# EAGLE design amc7135-by-12-16mm-led-aux-driver-mk-1.0 (EAGLE 7.5.0)
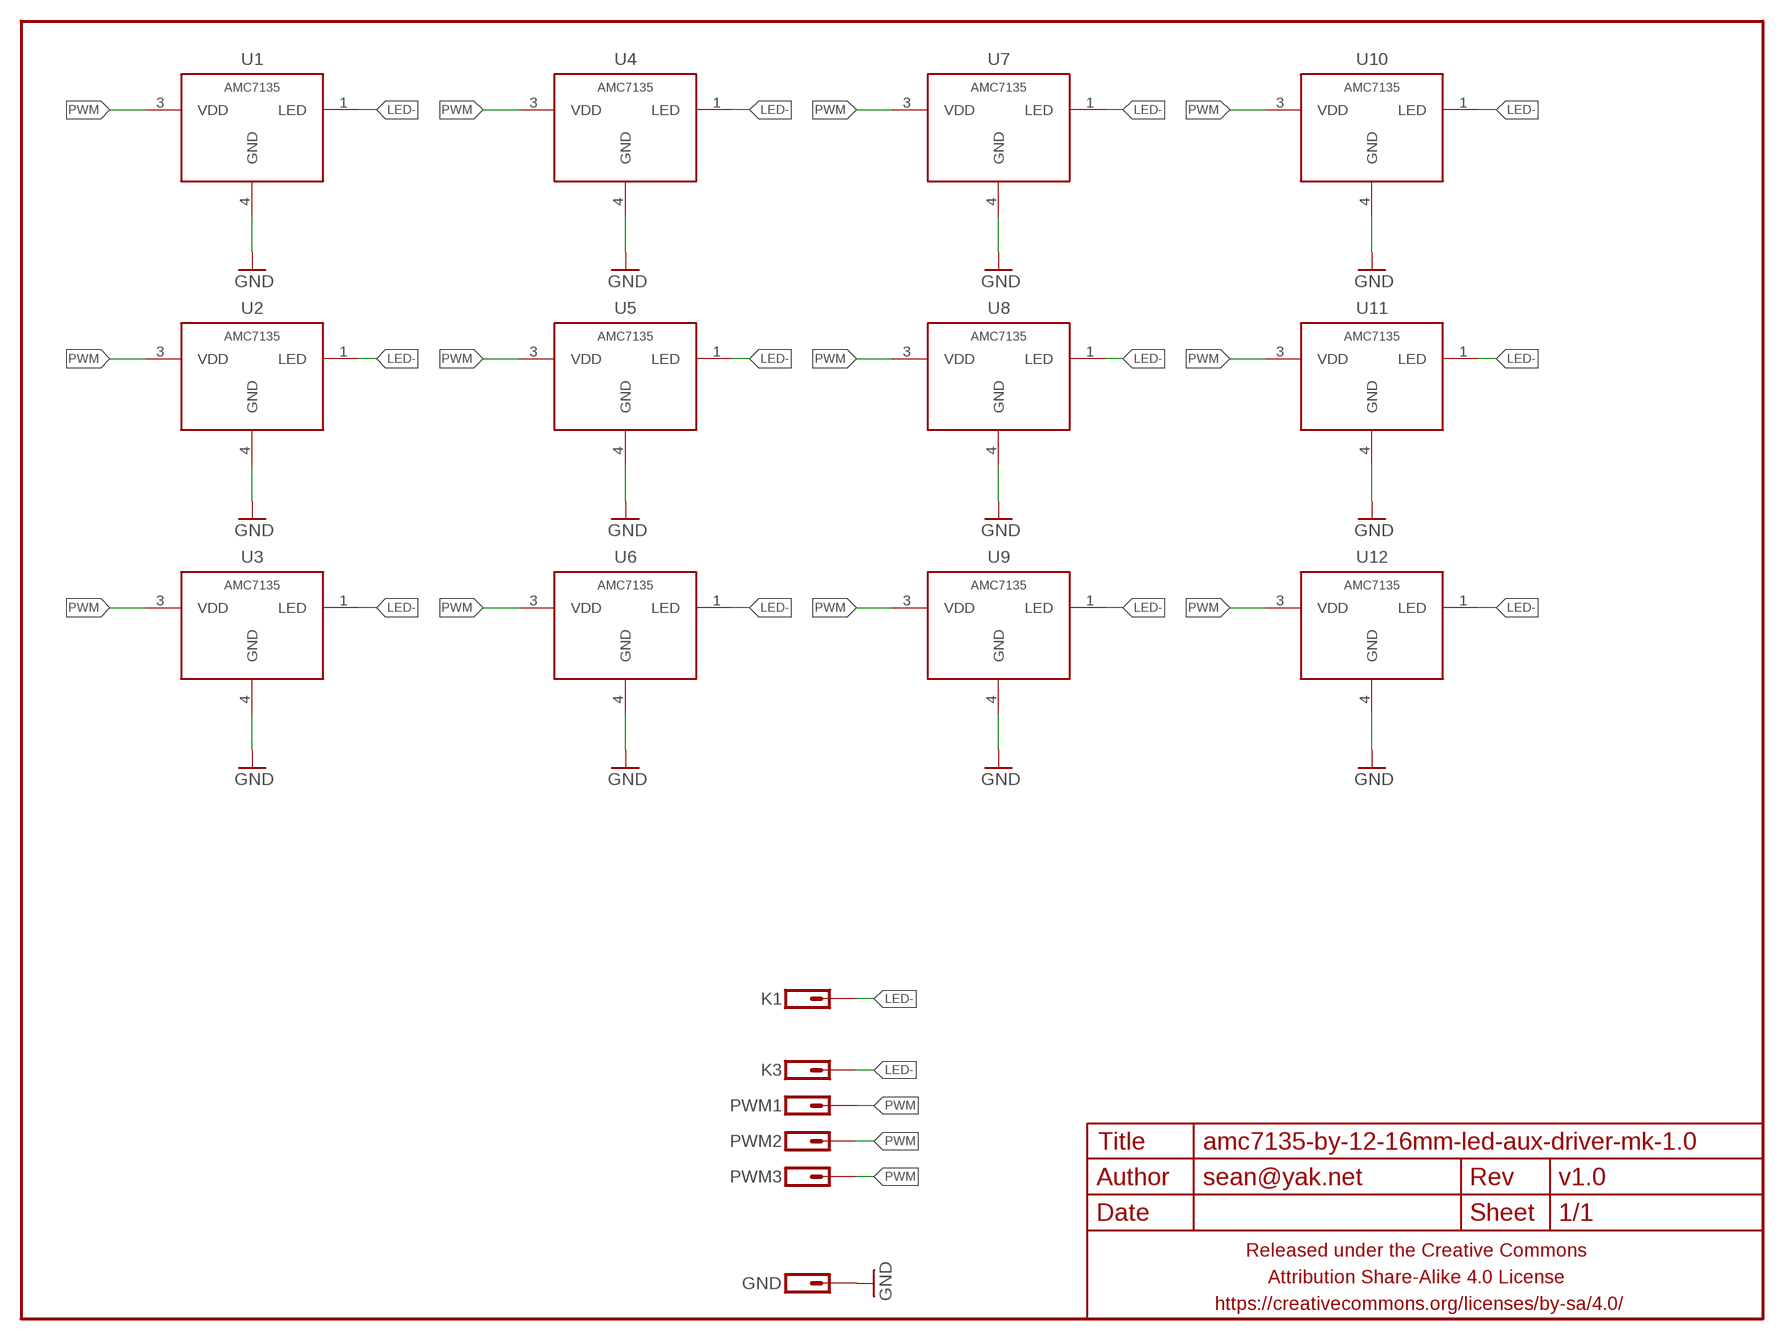
[diagram p0: schematic, sheet 1]

## Parts
FRAME1  FRAME-LETTERNO_PACKAGE  [DUMMY]
GND  M01SMD-1MM-DIA-NS  [1X01-SMD-1MM-DIA-NS]
K1  M011X01-0.9MM-CIR  [1X01-0.9MM-CIR]
K3  M01SMD-1MM-DIA-NS  [1X01-SMD-1MM-DIA-NS]
PWM1  M01PTH-0.7MM  [1X01-0.7MM]
PWM2  M01PTH-0.7MM  [1X01-0.7MM]
PWM3  M01SMD-1MM-DIA-NS  [1X01-SMD-1MM-DIA-NS]
U1  AMC7135  AMC7135SOT-89-NOTHERM-ROUNDED-LESS  [SOT89-NOTHERM-ROUNDED-LESS]
U2  AMC7135  AMC7135SOT-89-NOTHERM-ROUNDED-LESS  [SOT89-NOTHERM-ROUNDED-LESS]
U3  AMC7135  AMC7135SOT-89-NOTHERM-ROUNDED-LESS  [SOT89-NOTHERM-ROUNDED-LESS]
U4  AMC7135  AMC7135SOT-89-NOTHERM-ROUNDED-LESS  [SOT89-NOTHERM-ROUNDED-LESS]
U5  AMC7135  AMC7135SOT-89-NOTHERM-ROUNDED-LESS  [SOT89-NOTHERM-ROUNDED-LESS]
U6  AMC7135  AMC7135SOT-89-NOTHERM-ROUNDED-LESS  [SOT89-NOTHERM-ROUNDED-LESS]
U7  AMC7135  AMC7135SOT-89-NOTHERM-ROUNDED-LESS  [SOT89-NOTHERM-ROUNDED-LESS]
U8  AMC7135  AMC7135SOT-89-NOTHERM-ROUNDED-LESS  [SOT89-NOTHERM-ROUNDED-LESS]
U9  AMC7135  AMC7135SOT-89-NOTHERM-ROUNDED-LESS  [SOT89-NOTHERM-ROUNDED-LESS]
U10  AMC7135  AMC7135SOT-89-NOTHERM-ROUNDED-LESS  [SOT89-NOTHERM-ROUNDED-LESS]
U11  AMC7135  AMC7135SOT-89-NOTHERM-ROUNDED-LESS  [SOT89-NOTHERM-ROUNDED-LESS]
U12  AMC7135  AMC7135SOT-89-NOTHERM-ROUNDED-LESS  [SOT89-NOTHERM-ROUNDED-LESS]

## Nets
GND: GND.P$1 U1.4(GND) U2.4(GND) U3.4(GND) U4.4(GND) U5.4(GND) U6.4(GND) U7.4(GND) U8.4(GND) U9.4(GND) U10.4(GND) U11.4(GND) U12.4(GND)
LED-: K1.P$1 K3.P$1 U1.1(LED) U2.1(LED) U3.1(LED) U4.1(LED) U5.1(LED) U6.1(LED) U7.1(LED) U8.1(LED) U9.1(LED) U10.1(LED) U11.1(LED) U12.1(LED)
PWM: PWM1.1 PWM2.1 PWM3.P$1 U1.3(VDD) U2.3(VDD) U3.3(VDD) U4.3(VDD) U5.3(VDD) U6.3(VDD) U7.3(VDD) U8.3(VDD) U9.3(VDD) U10.3(VDD) U11.3(VDD) U12.3(VDD)

## Library data of the parts
FRAME1 = a_parts:FRAME-LETTER: Schematic Frame Standard 8.5x11 US Letter frame; DESIGNER: sean@yak.net; VERSION: v1.0
GND K1 K3 PWM1-PWM3 = a_parts:M01: Header 1 Standard 1-pin 0.1" header. Use with straight break away headers (SKU : PRT-00116), right angle break away headers (PRT-00553), swiss pins (PRT-00743), machine pins (PRT-00117), and female headers (PRT-00115).
U1-U12 = a_parts:AMC7135

## Board
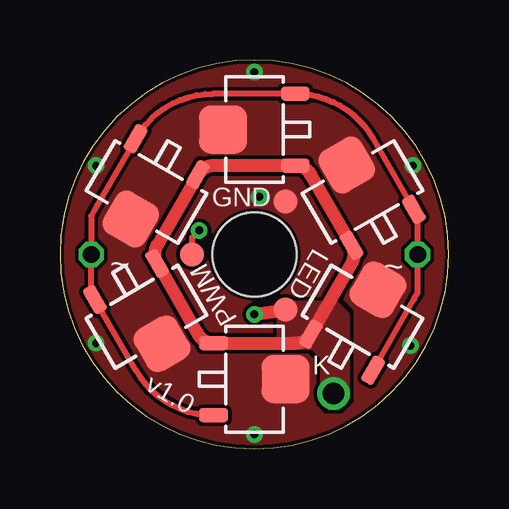
[diagram p1: board, top side]
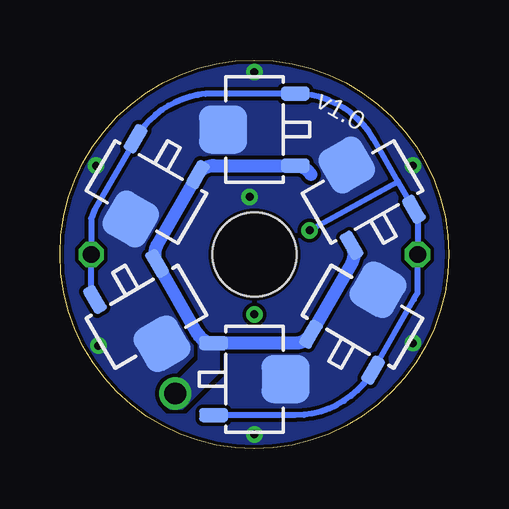
[diagram p2: board, bottom side, seen from below]

Size 16.2 x 16.2 mm. Coordinates in mm from the lower left corner, seen from the top.
Outline: 0,8.1 arc180 16.2,8.1 arc180 0,8.1
Copper layers (1*16): Top 0.0356mm / dielectric 1.5011mm / Bottom 0.0356mm
Design rules "LaenPCBOrder2": minimum track width 6mil, minimum drill 13mil, track to track 6mil, track to pad 6mil, pad to pad 6mil, via to via 6mil, smd to smd 6mil, copper to edge 6mil, drill to drill 6mil, minimum pad ring 7mil, minimum via ring 7mil, stop-mask expansion 3mil, vias tented up to drill 20mil, thermal gap 10mil
Holes 3.5 mm at 8.1,8.1

### Footprints (pad centres in the part's own frame; a part is rotated, then mirrored left to right if it is on the bottom)
1X01-SMD-1MM-DIA-NS = smd 1 x 1: P$1 0,0
1X01-0.9MM-CIR = drill 0.9 pad 1.3: P$1 0,0
1X01-0.7MM = drill 0.7 octagon: 1 0,0
SOT89-NOTHERM-ROUNDED-LESS = smd 0.58 x 1.2: 1 -1.5,-1.7; 3 1.5,-1.7 | smd 2 x 2: 4 0,1.3

### Placement (x,y rotation side)
FRAME1  0,0 0 top
GND  9.4,10.3 0 top
K1  11.4,2.3 0 top
K3  9.4,5.8 0 top
PWM1  14.9,8.1 0 top
PWM2  1.3,8.1 0 top
PWM3  5.5,8.1 0 top
U1  8.1,13.3 90 top
U2  12.6,10.7 30 top
U3  12.6,5.5 330 top
U4  8.1,2.9 270 top
U5  3.6,5.5 210 top
U6  3.6,10.7 150 top
U7  8.1,13.3 90 bottom
U8  12.6,10.7 150 bottom
U9  12.6,5.5 210 bottom
U10  8.1,2.9 270 bottom
U11  3.6,5.5 330 bottom
U12  3.6,10.7 30 bottom

### Tracks (layer width: path | path; a pad name or v marks a point on that pad's centre or on a via)
GND  (via drill 0.33)
  other vias: 1.5,4.4 1.5,11.8 8.1,15.7 14.7,11.8 14.6,4.3 8.1,0.6 8.3,10.5
  pour Bottom (isolate 0.152, rank 6, no thermals): 0,0 16.2,0 16.2,16.2 0,16.2
  pour Top (isolate 0.152, rank 6, no thermals): 16.2,0 0,0 0,16.2 16.2,16.2
LED-  (via drill 0.33)
  Top 0.55: v8.1,5.6 K3.P$1 | U6.1 U12.1 arc60 U5.1 U11.1 arc60 U4.1 U10.1 arc60 U3.1 U9.1 arc60 U2.1 U8.1 arc60 U1.1 U7.1 arc60 U6.1
  Bottom 0.55: U12.1 arc60 U5.1 U11.1 arc60 U4.1 U10.1 arc60 U3.1 U9.1 arc60 U2.1 U8.1 arc60 U1.1 U7.1 arc60 U6.1
  pour Top (isolate 0.152, rank 3, no thermals): 11.2,1.7 11.6,1.7 12,2.1 12,5.6 11.5,6.1 9.1,6.1 9.1,4.2 10.5,4.2 10.9,3.8 10.9,2
  pour Bottom (isolate 0.152, rank 3, no thermals): 11.9,2.5 11.6,2.8 11.3,2.8 10.4,3.7 10.4,4.6 9.6,4.6 9.6,3.2 11.1,1.7 11.6,1.7 11.9,2
PWM  (via drill 0.33)
  Top 0.25: U8.3 arc60 U1.3 U7.3 arc60 U6.3 U12.3 1.3,9.7 PWM2.1 1.3,6.5 U5.3 U11.3 arc60 U4.3 | 13,13 U2.3 14.9,9.6 PWM1.1 14.9,6.5 U9.3 U3.3 | PWM3.P$1 5.5,8.8 v5.8,9.1
  Bottom 0.25: 2.12,11.13 U6.3 arc-60 U7.3 U1.3 | 2.12,11.13 U12.3 1.3,9.7 PWM2.1 1.3,6.5 U5.3 U11.3 | U1.3 arc-60 U8.3 | U1.3 arc-60 U8.3 | U8.3 U2.3 14.9,9.6 PWM1.1 14.9,6.5 U9.3 | U11.3 arc60 U4.3 | U11.3 arc60 U4.3 | U4.3 U10.3 | v5.8,9.1 2.12,11.13

### Text on the board
tPlace: GND | ~ | PWM | ~ | LED | K